# Altium project Breakout.PrjPCB
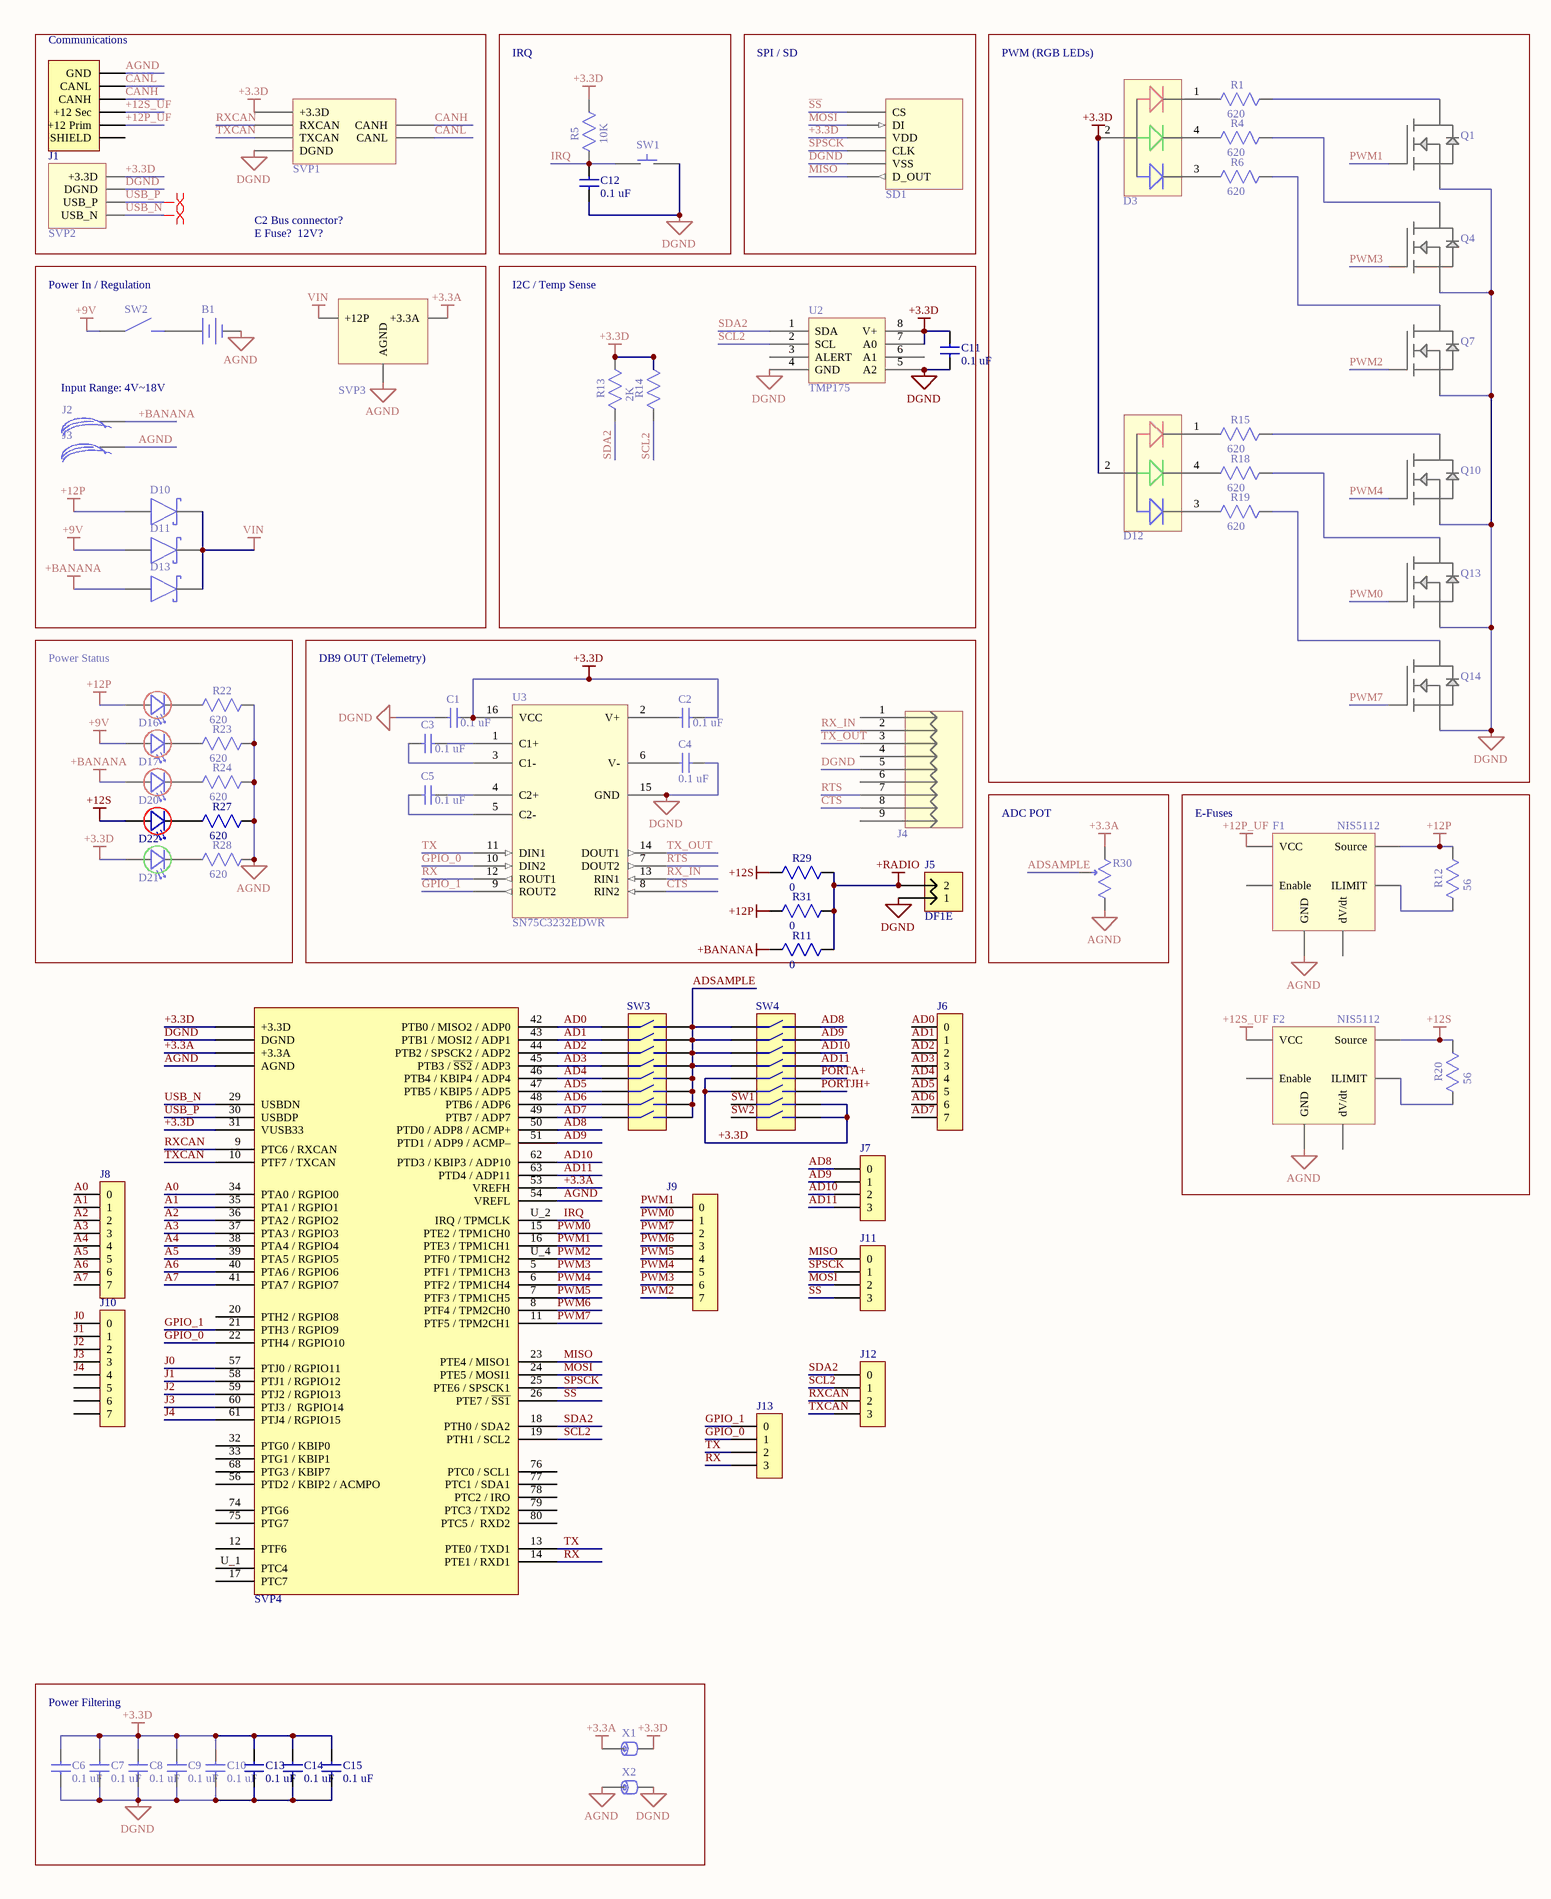
[diagram p0: Breakout.SchDoc, left]
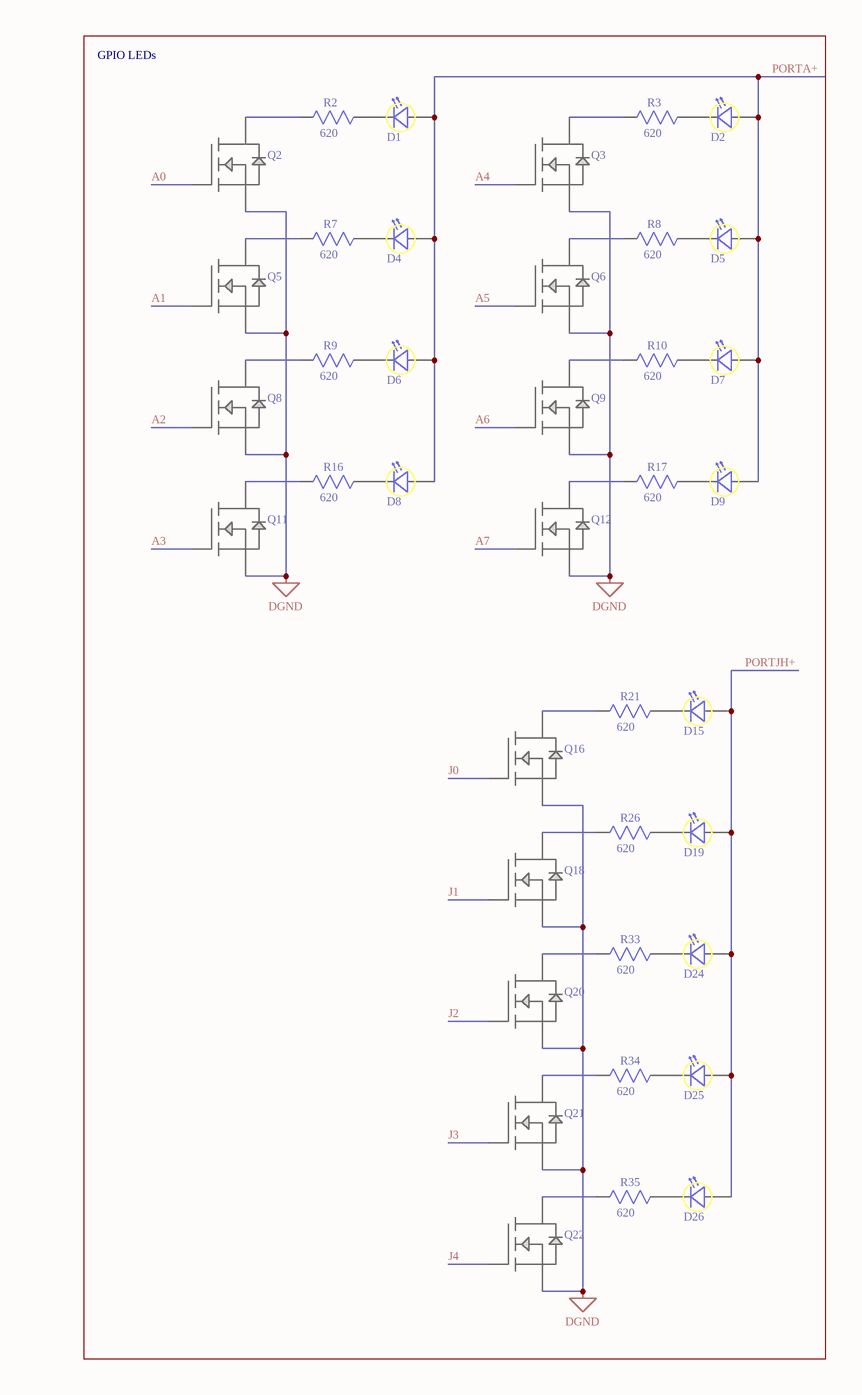
[diagram p1: Breakout.SchDoc, right]
1 sheet, 119 parts. Net scope: global (net labels, ports and power ports of the same name join across sheets).
Board file: Breakout.PcbDoc

## Sheet Breakout.SchDoc
size C

### Parts
B1  J_9V_BATT_CLIP  [Battery 9V]  (value not drawn)
C1  value 0.1 uF  [0805_Capacitor]  (hidden comment: CAP 0.1uF)
C2  value 0.1 uF  [0805_Capacitor]  (hidden comment: CAP 0.1uF)
C3  value 0.1 uF  [0805_Capacitor]  (hidden comment: CAP 0.1uF)
C4  value 0.1 uF  [0805_Capacitor]  (hidden comment: CAP 0.1uF)
C5  value 0.1 uF  [0805_Capacitor]  (hidden comment: CAP 0.1uF)
C6  value 0.1 uF  [0805_Capacitor]  (hidden comment: CAP 0.1uF)
C7  value 0.1 uF  [0805_Capacitor]  (hidden comment: CAP 0.1uF)
C8  value 0.1 uF  [0805_Capacitor]  (hidden comment: CAP 0.1uF)
C9  value 0.1 uF  [0805_Capacitor]  (hidden comment: CAP 0.1uF)
C10  value 0.1 uF  [0805_Capacitor]  (hidden comment: CAP 0.1uF)
C11  value 0.1 uF  [0805_Capacitor]  (hidden comment: CAP 0.1uF)
C12  value 0.1 uF  [0805_Capacitor]  (hidden comment: CAP 0.1uF)
C13  value 0.1 uF  [0805_Capacitor]  (hidden comment: CAP 0.1uF)
C14  value 0.1 uF  [0805_Capacitor]  (hidden comment: CAP 0.1uF)
C15  value 0.1 uF  [0805_Capacitor]  (hidden comment: CAP 0.1uF)
D1  D_LED_0805_YELLOW  [0805P_YELLOW]  (value not drawn)
D2  D_LED_0805_YELLOW  [0805P_YELLOW]  (value not drawn)
D3  D_RGB_PLCC4  [4-PLCC (RGB LED)]  (value not drawn)
D4  D_LED_0805_YELLOW  [0805P_YELLOW]  (value not drawn)
D5  D_LED_0805_YELLOW  [0805P_YELLOW]  (value not drawn)
D6  D_LED_0805_YELLOW  [0805P_YELLOW]  (value not drawn)
D7  D_LED_0805_YELLOW  [0805P_YELLOW]  (value not drawn)
D8  D_LED_0805_YELLOW  [0805P_YELLOW]  (value not drawn)
D9  D_LED_0805_YELLOW  [0805P_YELLOW]  (value not drawn)
D10  SCHOTTKY RECT 20V 1A SOD123F  [SOD123]  (value not drawn)
D11  SCHOTTKY RECT 20V 1A SOD123F  [SOD123]  (value not drawn)
D12  D_RGB_PLCC4  [4-PLCC (RGB LED)]  (value not drawn)
D13  SCHOTTKY RECT 20V 1A SOD123F  [SOD123]  (value not drawn)
D15  D_LED_0805_YELLOW  [0805P_YELLOW]  (value not drawn)
D16  D_LED_0805_RED  [0805P_RED]  (value not drawn)
D17  D_LED_0805_RED  [0805P_RED]  (value not drawn)
D19  D_LED_0805_YELLOW  [0805P_YELLOW]  (value not drawn)
D20  D_LED_0805_RED  [0805P_RED]  (value not drawn)
D21  D_LED_0805_GREEN  [0805P_GREEN]  (value not drawn)
D22  D_LED_0805_RED  [0805P_RED]  (value not drawn)
D24  D_LED_0805_YELLOW  [0805P_YELLOW]  (value not drawn)
D25  D_LED_0805_YELLOW  [0805P_YELLOW]  (value not drawn)
D26  D_LED_0805_YELLOW  [0805P_YELLOW]  (value not drawn)
F1  Manufacturer PN: NIS5112  [SOIC127P600X175-8N (NIS5112)]  (hidden comment: F_NIS5112)
F2  Manufacturer PN: NIS5112  [SOIC127P600X175-8N (NIS5112)]  (hidden comment: F_NIS5112)
J1  NC5MBH  [NC5MBH]  (value not drawn)
J2  POST BINDING TIN PLATE BRASS BLK  [BANANA_JACK]  (value not drawn)
J3  POST BINDING TIN PLATE BRASS BLK  [BANANA_JACK_BLACK]  (value not drawn)
J4  J_DB9F  [DB9F]  (value not drawn)
J5  value DF1E  [DF1EC-2P-2.5DSA]  (hidden comment: DF1E 2-pin Male Header)
J6  SOCKET_8PIN_0.100IN  [8PIN_.100IN]  (value not drawn)
J7  SOCKET_4PIN_0.100IN  [4PIN_.100IN]  (value not drawn)
J8  SOCKET_8PIN_0.100IN  [8PIN_.100IN]  (value not drawn)
J9  SOCKET_8PIN_0.100IN  [8PIN_.100IN]  (value not drawn)
J10  SOCKET_8PIN_0.100IN  [8PIN_.100IN]  (value not drawn)
J11  SOCKET_4PIN_0.100IN  [4PIN_.100IN]  (value not drawn)
J12  SOCKET_4PIN_0.100IN  [4PIN_.100IN]  (value not drawn)
J13  SOCKET_4PIN_0.100IN  [4PIN_.100IN]  (value not drawn)
Q1  RK7002BT116  [SOT-23]  (value not drawn)
Q2  RK7002BT116  [SOT-23]  (value not drawn)
Q3  RK7002BT116  [SOT-23]  (value not drawn)
Q4  RK7002BT116  [SOT-23]  (value not drawn)
Q5  RK7002BT116  [SOT-23]  (value not drawn)
Q6  RK7002BT116  [SOT-23]  (value not drawn)
Q7  RK7002BT116  [SOT-23]  (value not drawn)
Q8  RK7002BT116  [SOT-23]  (value not drawn)
Q9  RK7002BT116  [SOT-23]  (value not drawn)
Q10  RK7002BT116  [SOT-23]  (value not drawn)
Q11  RK7002BT116  [SOT-23]  (value not drawn)
Q12  RK7002BT116  [SOT-23]  (value not drawn)
Q13  RK7002BT116  [SOT-23]  (value not drawn)
Q14  RK7002BT116  [SOT-23]  (value not drawn)
Q16  RK7002BT116  [SOT-23]  (value not drawn)
Q18  RK7002BT116  [SOT-23]  (value not drawn)
Q20  RK7002BT116  [SOT-23]  (value not drawn)
Q21  RK7002BT116  [SOT-23]  (value not drawn)
Q22  RK7002BT116  [SOT-23]  (value not drawn)
R1  value 620  [0805_Resistor]  (hidden comment: R_0805_620_1%)
R2  value 620  [0805_Resistor]  (hidden comment: R_0805_620_1%)
R3  value 620  [0805_Resistor]  (hidden comment: R_0805_620_1%)
R4  value 620  [0805_Resistor]  (hidden comment: R_0805_620_1%)
R5  value 10K  [0805_Resistor]  (hidden comment: R_0805_10K_1%)
R6  value 620  [0805_Resistor]  (hidden comment: R_0805_620_1%)
R7  value 620  [0805_Resistor]  (hidden comment: R_0805_620_1%)
R8  value 620  [0805_Resistor]  (hidden comment: R_0805_620_1%)
R9  value 620  [0805_Resistor]  (hidden comment: R_0805_620_1%)
R10  value 620  [0805_Resistor]  (hidden comment: R_0805_620_1%)
R11  value 0  [0805_Resistor]  (hidden comment: R_0805_0)
R12  value 56  [0805_Resistor]  (hidden comment: R_0805_56_1%)
R13  value 2K  [0805_Resistor]  (hidden comment: R_0805_2K_1%)
R14  R_0805_2K_1%  [0805_Resistor]  (value not drawn)
R15  value 620  [0805_Resistor]  (hidden comment: R_0805_620_1%)
R16  value 620  [0805_Resistor]  (hidden comment: R_0805_620_1%)
R17  value 620  [0805_Resistor]  (hidden comment: R_0805_620_1%)
R18  value 620  [0805_Resistor]  (hidden comment: R_0805_620_1%)
R19  value 620  [0805_Resistor]  (hidden comment: R_0805_620_1%)
R20  value 56  [0805_Resistor]  (hidden comment: R_0805_56_1%)
R21  value 620  [0805_Resistor]  (hidden comment: R_0805_620_1%)
R22  value 620  [0805_Resistor]  (hidden comment: R_0805_620_1%)
R23  value 620  [0805_Resistor]  (hidden comment: R_0805_620_1%)
R24  value 620  [0805_Resistor]  (hidden comment: R_0805_620_1%)
R26  value 620  [0805_Resistor]  (hidden comment: R_0805_620_1%)
R27  value 620  [0805_Resistor]  (hidden comment: R_0805_620_1%)
R28  value 620  [0805_Resistor]  (hidden comment: R_0805_620_1%)
R29  value 0  [0805_Resistor]  (hidden comment: R_0805_0)
R30  POT 5K OHM 1/8W CARB VERTICAL  [POT_296]  (value not drawn)
R31  value 0  [0805_Resistor]  (hidden comment: R_0805_0)
R33  value 620  [0805_Resistor]  (hidden comment: R_0805_620_1%)
R34  value 620  [0805_Resistor]  (hidden comment: R_0805_620_1%)
R35  value 620  [0805_Resistor]  (hidden comment: R_0805_620_1%)
SD1  SD_DM1AA-SF-PEJ  [DM1AA]  (value not drawn)
SVP1  CAN Network Circuit  [SVP_CAN]  (value not drawn)
SVP2  USB Isolator and Connector  [SVP_USB]  (value not drawn)
SVP3  Common Power Supply  [SVP_PowerSupply]  (value not drawn)
SVP4  Common Micro  [SVP_Micro]  (value not drawn)
SW1  SW_TACT_SWITCH_6x6  [TACT_SWITCH_6x6]  (value not drawn)
SW2  SWITCH ROCKER SPST 15A W/MRKG  [Switch_Rocker]  (value not drawn)
SW3  SW_Switch SPST 8  [SWITCH_SPST_8]  (value not drawn)
SW4  SW_Switch SPST 8  [SWITCH_SPST_8]  (value not drawn)
U2  Manufacturer PN: TMP175  [SOIC127P600X175-8N (TMP175)]  (hidden comment: U_TMP175)
U3  value SN75C3232EDWR  [SOIC127P600X175-16N]  (hidden comment: U_SN75C3232EDWR)
X1  Ferrite Bead  [0805]  (value not drawn)
X2  Ferrite Bead  [0805]  (value not drawn)

### Blocks framed on the sheet
IRQ: C12 R5 SW1
SPI / SD: SD1
PWM (RGB LEDs): D3 D12 Q1 Q4 Q7 Q10 Q13 Q14 R1 R4 R6 R15 R18 R19
GPIO LEDs: D1 D2 D4-D9 D15 D19 D24-D26 Q2 Q3 Q5 Q6 Q8 Q9 Q11 Q12 Q16 Q18 Q20-Q22 R2 R3 R7-R10 R16 R17 R21 R26 R33-R35
I2C / Temp Sense: C11 R13 R14 U2
Power Status: D16 D17 D20-D22 R22-R24 R27 R28
DB9 OUT (Telemetry): C1-C5 J4 J5 R11 R29 R31 U3
ADC POT: R30
E-Fuses: F1 F2 R12 R20
Power Filtering: C6-C10 C13-C15 X1 X2

### Nets
3: SD1.6(VSS)
+3.3A: R30.2 SVP3.+3.3A SVP4.53(VREFH) SVP4.+3.3A X1.2
+3.3D: C1.2 C2.1 C6.1 C7.1 C8.1 C9.1 C10.1 C11.1 C13.1 C14.1 C15.1 D3.2(D+) D12.2(D+) D21.2(Anode) R5.1 R13.1 R14.1 SD1.4(VDD) SVP1.+3.3D SVP2.+3.3D SVP4.31(VUSB33) SVP4.+3.3D SW4.5 SW4.6 SW4.15 SW4.16 U2.7(A0) U2.8(V+) U3.16(VCC) X1.1
+9V: D11.1 D17.2(Anode) SW2.1
+12P: D10.1 D16.2(Anode) F1.5(Source) R12.1 R31.2
+12P_UF: F1.8(VCC) J1.5(+12_Prim)
+12S: D22.2(Anode) F2.5(Source) R20.1 R29.2
+12S_UF: F2.8(VCC) J1.4(+12_Sec)
+BANANA: D13.1 D20.2(Anode) J2.1 R11.2
+RADIO: J5.2 R11.1 R29.1 R31.1
AGND: B1.2(-) F1.1(GND) F2.1(GND) J1.1(GND) J3.1 R22.1 R23.1 R24.1 R27.1 R28.1 R30.1 SVP3.AGND SVP4.54(VREFL) SVP4.AGND X2.2
DGND: C1.1 C4.1 C6.2 C7.2 C8.2 C9.2 C10.2 C11.2 C12.2 C13.2 C14.2 C15.2 J4.5 J5.1 Q1.2(SOURCE) Q2.2(SOURCE) Q3.2(SOURCE) Q4.2(SOURCE) Q5.2(SOURCE) Q6.2(SOURCE) Q7.2(SOURCE) Q8.2(SOURCE) Q9.2(SOURCE) Q10.2(SOURCE) Q11.2(SOURCE) Q12.2(SOURCE) Q13.2(SOURCE) Q14.2(SOURCE) Q16.2(SOURCE) Q18.2(SOURCE) Q20.2(SOURCE) Q21.2(SOURCE) Q22.2(SOURCE) SD1.3(VSS) SVP1.DGND SVP2.DGND SVP4.DGND SW1.2 U2.4(GND) U2.5(A2) U3.15(GND) X2.1
VIN: D10.2 D11.2 D13.2 SVP3.+12P
A0: J8.1(0) Q2.1(GATE) SVP4.34(PTA0_/_RGPIO0)
A1: J8.2(1) Q5.1(GATE) SVP4.35(PTA1_/_RGPIO1)
A2: J8.3(2) Q8.1(GATE) SVP4.36(PTA2_/_RGPIO2)
A3: J8.4(3) Q11.1(GATE) SVP4.37(PTA3_/_RGPIO3)
A4: J8.5(4) Q3.1(GATE) SVP4.38(PTA4_/_RGPIO4)
A5: J8.6(5) Q6.1(GATE) SVP4.39(PTA5_/_RGPIO5)
A6: J8.7(6) Q9.1(GATE) SVP4.40(PTA6_/_RGPIO6)
A7: J8.8(7) Q12.1(GATE) SVP4.41(PTA7_/_RGPIO7)
AD0: J6.1(0) SVP4.42(PTB0_/_MISO2_/_ADP0) SW3.1
AD1: J6.2(1) SVP4.43(PTB1_/_MOSI2_/_ADP1) SW3.2
AD2: J6.3(2) SVP4.44(PTB2_/_SPSCK2_/_ADP2) SW3.3
AD3: J6.4(3) SVP4.45(PTB3_/_~{SS2}_/_ADP3) SW3.4
AD4: J6.5(4) SVP4.46(PTB4_/_KBIP4_/_ADP4) SW3.5
AD5: J6.6(5) SVP4.47(PTB5_/_KBIP5_/_ADP5) SW3.6
AD6: J6.7(6) SVP4.48(PTB6_/_ADP6) SW3.7
AD7: J6.8(7) SVP4.49(PTB7_/_ADP7) SW3.8
AD8: J7.1(0) SVP4.50(PTD0_/_ADP8_/_ACMP+) SW4.9
AD9: J7.2(1) SVP4.51(PTD1_/_ADP9_/_ACMP–) SW4.10
AD10: J7.3(2) SVP4.62(PTD3_/_KBIP3_/_ADP10) SW4.11
AD11: J7.4(3) SVP4.63(PTD4_/_ADP11) SW4.12
ADSAMPLE: R30.3 SW3.9 SW3.10 SW3.11 SW3.12 SW3.13 SW3.14 SW3.15 SW3.16 SW4.1 SW4.2 SW4.3 SW4.4
CANH: J1.3(CANH) SVP1.CANH
CANL: J1.2(CANL) SVP1.CANL
CTS: J4.8 U3.8(RIN2)
GPIO_0: J13.2(1) SVP4.22(PTH4_/_RGPIO10) U3.10(DIN2)
GPIO_1: J13.1(0) SVP4.21(PTH3_/_RGPIO9) U3.9(ROUT2)
IRQ: C12.1 R5.2 SVP4.U_2(IRQ_/_TPMCLK) SW1.1
J0: J10.1(0) Q16.1(GATE) SVP4.57(PTJ0_/_RGPIO11)
J1: J10.2(1) Q18.1(GATE) SVP4.58(PTJ1_/_RGPIO12)
J2: J10.3(2) Q20.1(GATE) SVP4.59(PTJ2_/_RGPIO13)
J3: J10.4(3) Q21.1(GATE) SVP4.60(PTJ3_/__RGPIO14)
J4: J10.5(4) Q22.1(GATE) SVP4.61(PTJ4_/_RGPIO15)
MISO: J11.1(0) SD1.7(D_OUT) SVP4.23(PTE4_/_MISO1)
MOSI: J11.3(2) SD1.2(DI) SVP4.24(PTE5_/_MOSI1)
PORTA+: D1.2(Anode) D2.2(Anode) D4.2(Anode) D5.2(Anode) D6.2(Anode) D7.2(Anode) D8.2(Anode) D9.2(Anode) SW4.13
PORTJH+: D15.2(Anode) D19.2(Anode) D24.2(Anode) D25.2(Anode) D26.2(Anode) SW4.14
PWM0: J9.2(1) Q13.1(GATE) SVP4.15(PTE2_/_TPM1CH0)
PWM1: J9.1(0) Q1.1(GATE) SVP4.16(PTE3_/_TPM1CH1)
PWM2: J9.8(7) Q7.1(GATE) SVP4.U_4(PTF0_/_TPM1CH2)
PWM3: J9.7(6) Q4.1(GATE) SVP4.5(PTF1_/_TPM1CH3)
PWM4: J9.6(5) Q10.1(GATE) SVP4.6(PTF2_/_TPM1CH4)
PWM5: J9.5(4) SVP4.7(PTF3_/_TPM1CH5)
PWM6: J9.4(3) SVP4.8(PTF4_/_TPM2CH0)
PWM7: J9.3(2) Q14.1(GATE) SVP4.11(PTF5_/_TPM2CH1)
RTS: J4.7 U3.7(DOUT2)
RX: J13.4(3) SVP4.14(PTE1_/_RXD1) U3.12(ROUT1)
RX_IN: J4.2 U3.13(RIN1)
RXCAN: J12.3(2) SVP1.RXCAN SVP4.9(PTC6_/_RXCAN)
~{SS}: J11.4(3) SD1.1(CS) SVP4.26(PTE7_/_~{SS1})
SCL2: J12.2(1) R14.2 SVP4.19(PTH1_/_SCL2) U2.2(SCL)
SDA2: J12.1(0) R13.2 SVP4.18(PTH0_/_SDA2) U2.1(SDA)
SPSCK: J11.2(1) SD1.5(CLK) SVP4.25(PTE6_/_SPSCK1)
SW1: SW4.7
SW2: SW4.8
TX: J13.3(2) SVP4.13(PTE0_/_TXD1) U3.11(DIN1)
TX_OUT: J4.3 U3.14(DOUT1)
TXCAN: J12.4(3) SVP1.TXCAN SVP4.10(PTF7_/_TXCAN)
USB_N: SVP2.USB_N SVP4.29(USBDN)
USB_P: SVP2.USB_P SVP4.30(USBDP)
NetB1_1: B1.1(+) SW2.2
NetC2_2: C2.2 U3.2(V+)
NetC3_1: C3.1 U3.1(C1+)
NetC3_2: C3.2 U3.3(C1-)
NetC4_2: C4.2 U3.6(V-)
NetC5_1: C5.1 U3.4(C2+)
NetC5_2: C5.2 U3.5(C2-)
NetD1_1: D1.1(Cathode) R2.1
NetD2_1: D2.1(Cathode) R3.1
NetD3_1: D3.1(R-) R1.2
NetD3_3: D3.3(B-) R6.2
NetD3_4: D3.4(G-) R4.2
NetD4_1: D4.1(Cathode) R7.1
NetD5_1: D5.1(Cathode) R8.1
NetD6_1: D6.1(Cathode) R9.1
NetD7_1: D7.1(Cathode) R10.1
NetD8_1: D8.1(Cathode) R16.1
NetD9_1: D9.1(Cathode) R17.1
NetD12_1: D12.1(R-) R15.2
NetD12_3: D12.3(B-) R19.2
NetD12_4: D12.4(G-) R18.2
NetD15_1: D15.1(Cathode) R21.1
NetD16_1: D16.1(Cathode) R22.2
NetD17_1: D17.1(Cathode) R23.2
NetD19_1: D19.1(Cathode) R26.1
NetD20_1: D20.1(Cathode) R24.2
NetD21_1: D21.1(Cathode) R28.2
NetD22_1: D22.1(Cathode) R27.2
NetD24_1: D24.1(Cathode) R33.1
NetD25_1: D25.1(Cathode) R34.1
NetD26_1: D26.1(Cathode) R35.1
NetF1_4: F1.4(ILIMIT) R12.2
NetF2_4: F2.4(ILIMIT) R20.2
NetQ1_3: Q1.3(DRAIN) R1.1
NetQ2_3: Q2.3(DRAIN) R2.2
NetQ3_3: Q3.3(DRAIN) R3.2
NetQ4_3: Q4.3(DRAIN) R4.1
NetQ5_3: Q5.3(DRAIN) R7.2
NetQ6_3: Q6.3(DRAIN) R8.2
NetQ7_3: Q7.3(DRAIN) R6.1
NetQ8_3: Q8.3(DRAIN) R9.2
NetQ9_3: Q9.3(DRAIN) R10.2
NetQ10_3: Q10.3(DRAIN) R15.1
NetQ11_3: Q11.3(DRAIN) R16.2
NetQ12_3: Q12.3(DRAIN) R17.2
NetQ13_3: Q13.3(DRAIN) R18.1
NetQ14_3: Q14.3(DRAIN) R19.1
NetQ16_3: Q16.3(DRAIN) R21.2
NetQ18_3: Q18.3(DRAIN) R26.2
NetQ20_3: Q20.3(DRAIN) R33.2
NetQ21_3: Q21.3(DRAIN) R34.2
NetQ22_3: Q22.3(DRAIN) R35.2

Not connected (* = marked no-connect by the designer): F1 2(dV/dt) 3(Enable); F2 2(dV/dt) 3(Enable); J1 6(SHIELD); J4 1 4 6 9; J10 6(5) 7(6) 8(7); SVP4 12(PTF6) 17(PTC7) 20(PTH2_/_RGPIO8) 32(PTG0_/_KBIP0) 33(PTG1_/_KBIP1) 56(PTD2_/_KBIP2_/_ACMPO) 68(PTG3_/_KBIP7) 74(PTG6) 75(PTG7) 76(PTC0_/_SCL1) 77(PTC1_/_SDA1) 78(PTC2_/_IRO) 79(PTC3_/_TXD2) 80(PTC5_/__RXD2) U_1(PTC4); U2 3(ALERT) 6(A1)

### Layout directives
differential pair: USB_N, USB_P

### Notes on the sheet
- (near J1) Communications
- C2 Bus connector?
- E Fuse?  12V?
- Power In / Regulation
- (near J2) Input Range: 4V~18V

### Library data of the parts
B1 = J_9V_BATT_CLIP: HOLDER BATTERY 9V PC MOUNT; pin to pad: 1>2 2>1; Manufacturer: MPD; Manufacturer PN: BH9V-PC; SVP Creator: Kathleen; SVP Reviewer 1: Trevor Haag; Known Distributors: Digikey; Price: 1.15; HelpURL: http://umnsvp.dyndns.org/svn/centaurus2/datasheets/Common_breakout_board/BH9VPC.pdf; ComponentLink1URL: http://umnsvp.dyndns.org/svn/centaurus2/datasheets/Common_breakout_board/BH9VPC.pdf; ComponentLink1Description: Datasheet
C1-C5 C11-C15 = C_0805_0.1uF: CAP CERM 0.1uF; Manufacturer: Yageo; Manufacturer PN: CC0805ZRY5V9BB104; SVP Creator: Brett Paulsen; Package: 0805; Known Distributors: Digikey; ComponentLink1Description: Datasheet; ComponentLink1URL: SVN Datasheet URL; Price: .028
C6-C10 = C_0805_0.1uF_1: CAP CERM 0.1uF; Manufacturer: Yageo; Manufacturer PN: CC0805ZRY5V9BB104; SVP Creator: Brett Paulsen; Package: 0805; Known Distributors: Digikey; ComponentLink1Description: Datasheet; ComponentLink1URL: SVN Datasheet URL; Price: .028
D1 D2 D4-D9 D15 D19 D24-D26 = D_LED_0805_YELLOW: LED 595NM AMBER DIFF SMD 0805; SVP Creator: Jonathan Nutzmann; Current: 20mA; Forward Voltage: 1.9; Value: YELLOW; Package: 0805; Known Distributors: Digikey; ComponentLink1Description: Datasheet
D3 D12 = D_RGB_PLCC4: LED RED/GREEN/BLUE PLCC4 SMD; Mfg Part Number: CLV1A-FKB-CJ1M1F1BB7R4S3; SVP Creator: Jonathan Nutzmann; Digikey PN: CLV1A-FKB-CJ1M1F1BB7R4S3CT-ND; Cost: 0.94; Datasheet: http://www.cree.com/products/pdf/LEDlamps/CLV1A-FKB(874).pdf
D10 D11 D13 = D_Schottky_PMEG2010: Manufacturer: NXP Semiconductors; Manufacturer PN: PMEG2010AEH T/R; SVP Creator: Joanthan Nutzmann; Package: SOD123F; Known Distributors: Digi-Key; Price: .46; HelpURL: http://umnsvp.dyndns.org/svn/centaurus2/datasheets/common parts/PMEG2010AEH_PMEG2010AET_3.pdf; ComponentLink1URL: http://umnsvp.dyndns.org/svn/centaurus2/datasheets/common parts/PMEG2010AEH_PMEG2010AET_3.pdf; ComponentLink1Description: Datasheet
D16 D17 D20 D22 = D_LED_0805_RED: LED CHIPLED 645NM RED DIFF 0805; SVP Creator: Jonathan Nutzmann; Current: 20mA; Forward Voltage: 1.8; Package: 0805; Known Distributors: Digikey; Value: RED; ComponentLink1Description: Datasheet
D21 = D_LED_0805_GREEN: LED CHIPLED 570NM GREEN 0805 SMD; Manufacturer: Osram Opto Semiconductors Inc; Manufacturer PN: LG R971-KN-1-0-20-R18; SVP Creator: Nate Bolyard; SVP Reviewer 1: Trevtron; Current: 20mA; Forward Voltage: 2.2V; Package: 0805; Known Distributors: Digikey; Value: GREEN; HelpURL: http://umnsvp.dyndns.org/svn/centaurus2/datasheets/common parts/LG_R971.pdf; ComponentLink1URL: http://umnsvp.dyndns.org/svn/centaurus2/datasheets/common parts/LG_R971.pdf; ComponentLink1Description: Datasheet
F1 F2 = F_NIS5112: IC ELECTRONIC FUSE HOTSWAP 8SOIC; Manufacturer: On Semiconductor; SVP Creator: Jonathan Nutzmann; Value: 12V E-Fuse; Package: SOIC-8; ComponentLink1Description: Datasheet
J1 = NC5MBH: C3 Bus Connector; Manufacturer: Neutrik; SVP Creator: Adam Shea; SVP Reviewer 1: Nate Bolyard; SVP Reviewer 2: Trevtron; Package: NC5MBH; Known Distributors: Neutrik; Manufacturer PN: NC5MBH; HelpURL: http://umnsvp-backup.dyndns.org/svn/centaurus2/datasheets/neutrik/PCB/NC5MBH.pdf; ComponentLink1URL: http://umnsvp-backup.dyndns.org/svn/centaurus2/datasheets/neutrik/PCB/NC5MBH.pdf; ComponentLink1Description: Datasheet
J2 J3 = J_Banana_Post: Manufacturer: Pomona Electronics; Manufacturer PN: 3760-0; SVP Creator: Wriju Bhattacharya; Known Distributors: Digi-Key; Price: 3.02; HelpURL: http://umnsvp.dyndns.org/svn/centaurus2/datasheets/Common_breakout_board/d3750-3760-3770_101.pdf; ComponentLink1URL: http://umnsvp.dyndns.org/svn/centaurus2/datasheets/Common_breakout_board/d3750-3760-3770_101.pdf; ComponentLink1Description: Datasheet
J4 = J_DB9F: DB9F connection; SVP Creator: Sam Kelley; Known Distributors: the shop; Price: free
J5 = DF1E_2_S_1: 2-pin Hirose; Manufacturer: Hirose Electric Co Ltd; Manufacturer PN: DF1EC-2P-2.5DSA(05); SVP Creator: Nate Untiedt; Package: DF1EC-2; Known Distributors: Digikey; HelpURL: http://umnsvp.dyndns.org/svn/centaurus2/datasheets/common%20parts/DF1E.pdf; ComponentLink1URL: http://umnsvp.dyndns.org/svn/centaurus2/datasheets/common%20parts/DF1E.pdf; ComponentLink1Description: Datasheet
J6 J8-J10 = J_SOCKET_8PIN_.100IN: CONN HEADER FEM 8POS .1" SGL GLD; Manufacturer: Sullins Connector Solutions; Manufacturer PN: PPPC081LFBN; SVP Creator: Nate Bolyard; SVP Reviewer 1: Trevtron; Package: 0.100IN; Known Distributors: Digikey; HelpURL: http://umnsvp.dyndns.org/svn/centaurus2/datasheets/Common_breakout_board/PP_Cxx1LFBN.pdf; ComponentLink1URL: http://umnsvp.dyndns.org/svn/centaurus2/datasheets/Common_breakout_board/PP_Cxx1LFBN.pdf; ComponentLink1Description: Datasheet
J7 J11-J13 = J_SOCKET_4PIN_.100IN: CONN HEADER FEMALE 4POS .1" GOLD; Manufacturer: Sullins Connector Solutions; Manufacturer PN: PPPC041LFBN-RC; SVP Creator: Nate Untiedt; Package: 0.100IN; Known Distributors: Digikey; Price: .44; HelpURL: http://umnsvp.dyndns.org/svn/centaurus2/datasheets/Common_breakout_board/PP_Cxx1LFBN.pdf; ComponentLink1URL: http://umnsvp.dyndns.org/svn/centaurus2/datasheets/Common_breakout_board/PP_Cxx1LFBN.pdf; ComponentLink1Description: Datasheet
Q1-Q14 Q16 Q18 Q20-Q22 = Q_N_60V_250MA_SOT23: MOSFET N-CH 60V 250MA SOT-23; Manufacturer: Rohm Semiconductor; SVP Creator: Jonathan Nutzmann; Package: SOT-23-3; Known Distributors: Digikey; Manufacturer PN: RK7002BT116; Price: .13@25; ComponentLink1Description: Datasheet
R1-R4 R6-R10 R15-R19 R21-R24 R26-R28 R33-R35 = R_0805_620_1%: RES 620 OHM 1/8W 1% 0805 SMD; Power Rating: .125W; SVP Creator: Jonathan Nutzmann; Package: 0805; Known Distributor: Digikey; ComponentLink1Description: Datasheet
R5 = R_0805_10K_1%: RES 10K OHM 1/8W 1% 0805 SMD; Power Rating: .125W; SVP Creator: Jonathan Nutzmann; Package: 0805; Known Distributor: Digikey; ComponentLink1Description: Datasheet
R11 R29 R31 = R_0805_0: RES 0 OHM 0805 SMD; Power Rating: .125W; SVP Creator: Jonathan Nutzmann; Package: 0805; Known Distributor: Digikey; ComponentLink1Description: Datasheet
R12 R20 = R_0805_56_1%: RES 56 OHM 1/8W 1% 0805 SMD; Power Rating: .125W; SVP Creator: Jonathan Nutzmann; Package: 0805; Known Distributor: Digikey; ComponentLink1Description: Datasheet
R13 R14 = R_0805_2K_1%_2K: RES 2K OHM 1/8W 1% 0805 SMD; Power Rating: .125W; SVP Creator: Jonathan Nutzmann; Package: 0805; Known Distributor: Digikey; ComponentLink1Description: Datasheet
R30 = R_POT_5k: pin to pad: 2>3 3>2; Manufacturer: CTS Corporation Electrocomponents; Manufacturer PN: 296UD502B1N; SVP Creator: Jonathan Nutzmann; Known Distributors: Digi-Key; Price: 1.51; HelpURL: http://umnsvp.dyndns.org/svn/centaurus2/datasheets/Common_breakout_board/296.pdf; ComponentLink1URL: http://umnsvp.dyndns.org/svn/centaurus2/datasheets/Common_breakout_board/296.pdf; ComponentLink1Description: Datasheet
SD1 = SD_DM1AA-SF-PEJ: CONN MEMORY SECURE DIGITAL SMD; Manufacturer: Hirose Electric Co Ltd; SVP Creator: sam kelley; Known Distributors: digikey; Manufacturer PN: DM1AA-SF-PEJ; Price: $3.86; HelpURL: http://umnsvp.dyndns.org/svn/centaurus2/datasheets/Telemetry/DM3AT-SF-PEJ.php; ComponentLink1URL: http://umnsvp.dyndns.org/svn/centaurus2/datasheets/Telemetry/DM3AT-SF-PEJ.php; ComponentLink1Description: Datasheet
SVP1 = SVP_CAN: Manufacturer PN: 42; SVP Creator: Jonathan Nutzmann; Package: Custom; Known Distributors: Jonathan Nutzmann; Manufacturer: Jonathan Nutzmann; ComponentLink1Description: Datasheet; ComponentLink1URL: SVN Datasheet URL
SVP2 = SVP_USB_ISOLATION: Isolates USB and has output connector; Manufacturer PN: 42; SVP Creator: Jonathan Nutzmann; Package: Custom; Known Distributors: Jonathan Nutzmann; Manufacturer: Jonathan Nutzmann; ComponentLink1Description: Datasheet; ComponentLink1URL: SVN Datasheet URL
SVP3 = SVP_LM2650PS: Buck converter to take the +12P rail to +3.3; Manufacturer PN: 42; SVP Creator: Jonathan Nutzmann; Package: Custom; Known Distributors: Jonathan Nutzmann; Manufacturer: Jonathan Nutzmann; ComponentLink1Description: Datasheet; ComponentLink1URL: SVN Datasheet URL
SVP4 = SVP_Micro: Micro/BDM/Reset/Clock; Manufacturer PN: 42; SVP Creator: Jonathan Nutzmann; Package: Custom; Known Distributors: Jonathan Nutzmann; Manufacturer: Jonathan Nutzmann; ComponentLink1Description: Datasheet; ComponentLink1URL: SVN Datasheet URL
SW1 = SW_TACT_SWITCH_6x6: SWITCH TACT 6MM BLACK 160GF; Manufacturer: Tyco Electronics; Manufacturer PN: FSM4JH; SVP Creator: Nate Bolyard; Known Distributors: Digikey; Package: 6mm x 6mm
SW2 = SW_SPST_Rocker: Manufacturer: E-Switch; Manufacturer PN: R1966ABLKBLKGS; SVP Creator: Jonathan Nutzmann; Known Distributors: Digi-Key; Price: 1.54; HelpURL: http://umnsvp.dyndns.org/svn/centaurus2/datasheets/Common_breakout_board/M301208B.pdf; ComponentLink1URL: http://umnsvp.dyndns.org/svn/centaurus2/datasheets/Common_breakout_board/M301208B.pdf; ComponentLink1Description: Datasheet
SW3 SW4 = SW_Switch SPST 8: SWITCH SPST GOLD 8 SEC; pin to pad: 9>16 10>15 11>14 12>13 13>12 14>11 15>10 16>9; Manufacturer: CTS Corporation Electrocomponents; Manufacturer PN: 206-8; SVP Creator: Wriju Bhattacharya; SVP Reviewer 1: Trevtron; Known Distributors: Digi-Key; Price: 0.65; HelpURL: http://umnsvp.dyndns.org/svn/centaurus2/datasheets/Common_breakout_board/206-208.pdf; ComponentLink1URL: http://umnsvp.dyndns.org/svn/centaurus2/datasheets/Common_breakout_board/206-208.pdf; ComponentLink1Description: Datasheet
U2 = U_TMP175: I2C Temperature Sensor SOIC-8; Manufacturer: Texas Insturments; SVP Creator: Jonathan Nutzmann; Package: SOIC-8; HelpURL: http://umnsvp.dyndns.org/svn/centaurus2/datasheets/; ComponentLink1URL: http://umnsvp.dyndns.org/svn/centaurus2/datasheets/; ComponentLink1Description: Datasheet
U3 = U_SN75C3232EDWR: IC LINE DRVR/RCVR RS232 16-SOIC; Manufacturer: TI; SVP Creator: Jonathan Nutzmann; Known Distributors: Digikey; Manufacturer PN: SN75C3232EDWR; ComponentLink1Description: Datasheet
X1 X2 = X_FERRITE_0805: FERRITE CHIP BEAD 600 OHM SMD; Package: 0805; Known Distributors: Digikey